# Altium schematic sheet indicator.schdoc: INDICATOR
size A4; Date: 10.03.2026; CheckedBy: BCY; DrawnBy: miaow; Revision: v1.0.0; SheetNumber: 15; SheetTotal: 17; BoardType: MAIN_PCB; Desc: LEDs
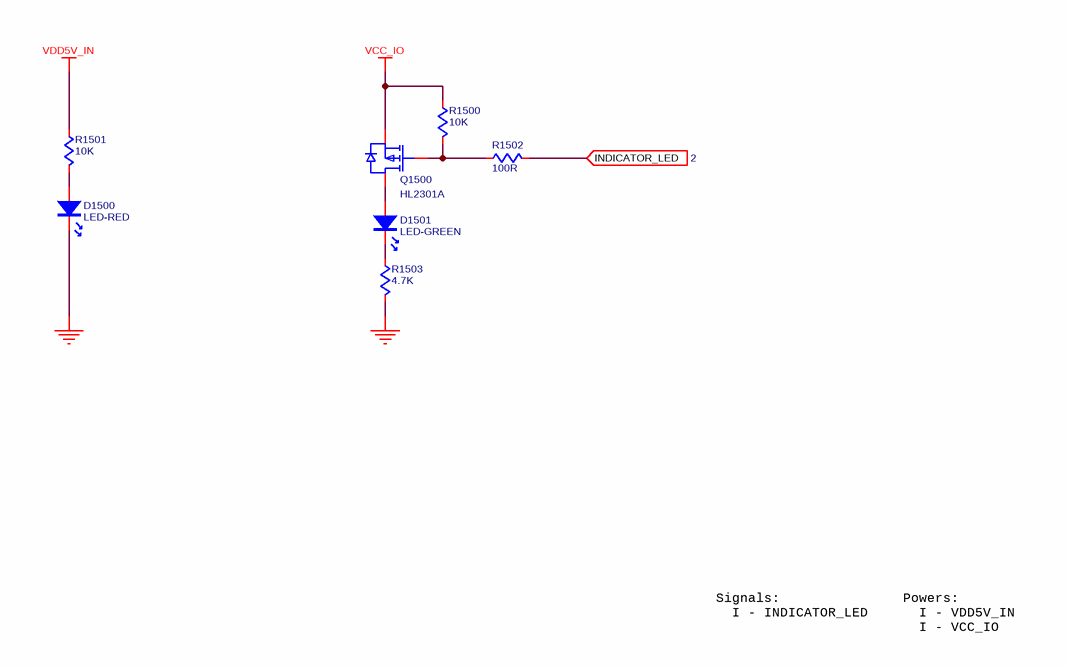
[diagram p0: indicator.schdoc]

## Parts
D1500  LED-RED  [LED0603]
D1501  LED-GREEN  [LED0603]
Q1500  HL2301A  [HL2301A]
R1500  value 10K  [R0402]  (hidden comment: R)
R1501  value 10K  [R0402]  (hidden comment: R)
R1502  value 100R  [R0402]  (hidden comment: R)
R1503  value 4.7K  [R0402]  (hidden comment: R)

## Ports
INDICATOR_LED (in, see 2)

## Nets
GND: D1500.1 R1503.1
VCC_IO: Q1500.S R1500.2
VDD5V_IN: R1501.2
INDICATOR_LED: R1502.1 ; port INDICATOR_LED
NetD1500_2: D1500.2 R1501.1
NetD1501_1: D1501.1 R1503.2
NetD1501_2: D1501.2 Q1500.D
NetQ1500_G: Q1500.G R1500.1 R1502.2

## Notes on the sheet
- Signals:
  I - INDICATOR_LED
- Powers:
  I - VDD5V_IN
  I - VCC_IO
- DRAWN
- CHECKED
- DRAWNBY
- SHEETS
- SHEETS_NO

## Library data of the parts
D1500 D1501 = LED: Supplier 1: LCSC
  D1500: Supplier Part Number 1: C84263
  D1501: Supplier Part Number 1: C19189745
Q1500 = HL2301A: PMOS; Supplier 1: LCSC; Supplier Part Number 1: C7420344
R1500-R1503 = R: precision: 1%; Supplier 1: LCSC
  R1500 R1501: Supplier Part Number 1: C25744
  R1502: Supplier Part Number 1: C25076
  R1503: Supplier Part Number 1: C25900